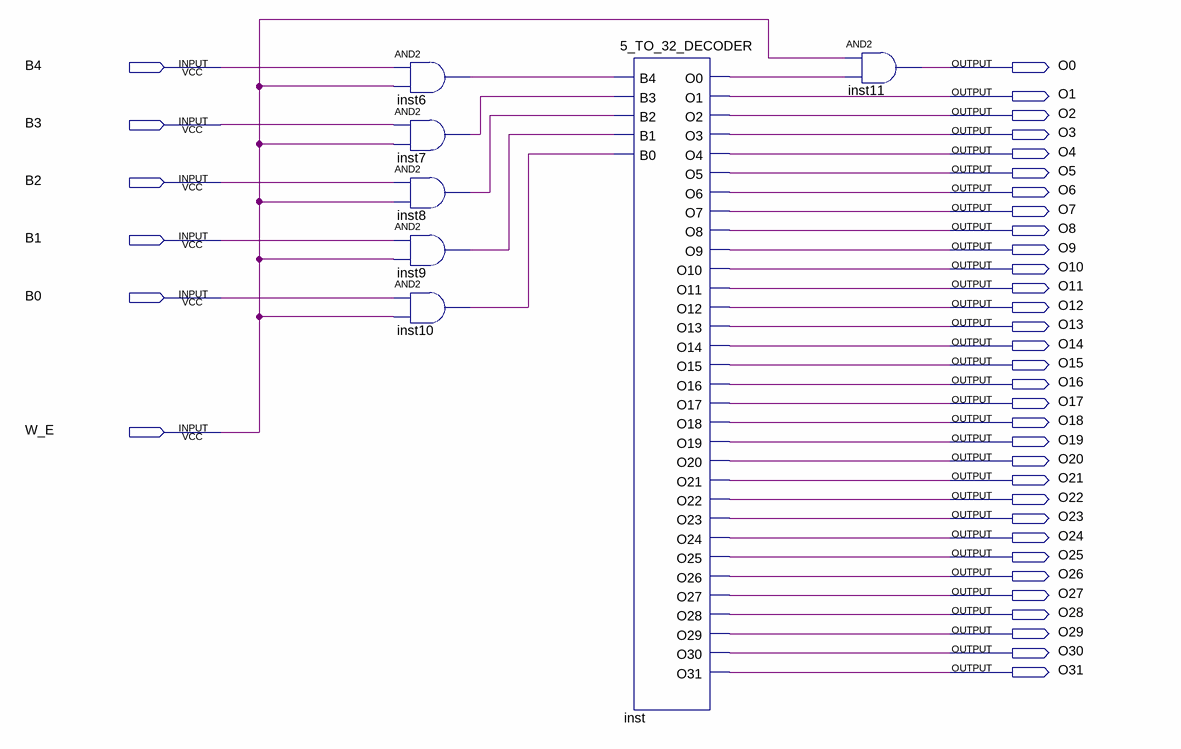
[diagram p0: schematic sheet]
// Quartus schematic 5_TO_32_DECODER_W_E.bdf as structural Verilog: 7 symbols, 38 pins
module \5_TO_32_DECODER_W_E  (
  input  B4,
  input  B3,
  input  B2,
  input  B1,
  input  B0,
  input  W_E,
  output O0,
  output O1,
  output O2,
  output O3,
  output O4,
  output O5,
  output O6,
  output O7,
  output O8,
  output O9,
  output O10,
  output O11,
  output O12,
  output O13,
  output O14,
  output O15,
  output O16,
  output O17,
  output O18,
  output O19,
  output O20,
  output O21,
  output O22,
  output O23,
  output O24,
  output O25,
  output O26,
  output O27,
  output O28,
  output O29,
  output O30,
  output O31
);

  wire inst6_out, inst7_out, inst8_out, inst9_out, inst10_out, inst_o0;

  and inst6 (inst6_out, B4, W_E);
  and inst7 (inst7_out, B3, W_E);
  and inst8 (inst8_out, B2, W_E);
  and inst9 (inst9_out, B1, W_E);
  and inst10 (inst10_out, B0, W_E);
  \5_TO_32_DECODER  inst (
    .B4(inst6_out), .B3(inst7_out), .B2(inst8_out), .B1(inst9_out), .B0(inst10_out), .O0(inst_o0), .O1(O1),
    .O2(O2), .O3(O3), .O4(O4), .O5(O5), .O6(O6), .O7(O7), .O8(O8), .O9(O9), .O10(O10), .O11(O11), .O12(O12),
    .O13(O13), .O14(O14), .O15(O15), .O16(O16), .O17(O17), .O18(O18), .O19(O19), .O20(O20), .O21(O21),
    .O22(O22), .O23(O23), .O24(O24), .O25(O25), .O26(O26), .O27(O27), .O28(O28), .O29(O29), .O30(O30),
    .O31(O31));
  and inst11 (O0, W_E, inst_o0);
endmodule
